# Altium schematic sheet SwitchModule.SchDoc
size A4; SheetNumber: 1; SheetTotal: 1
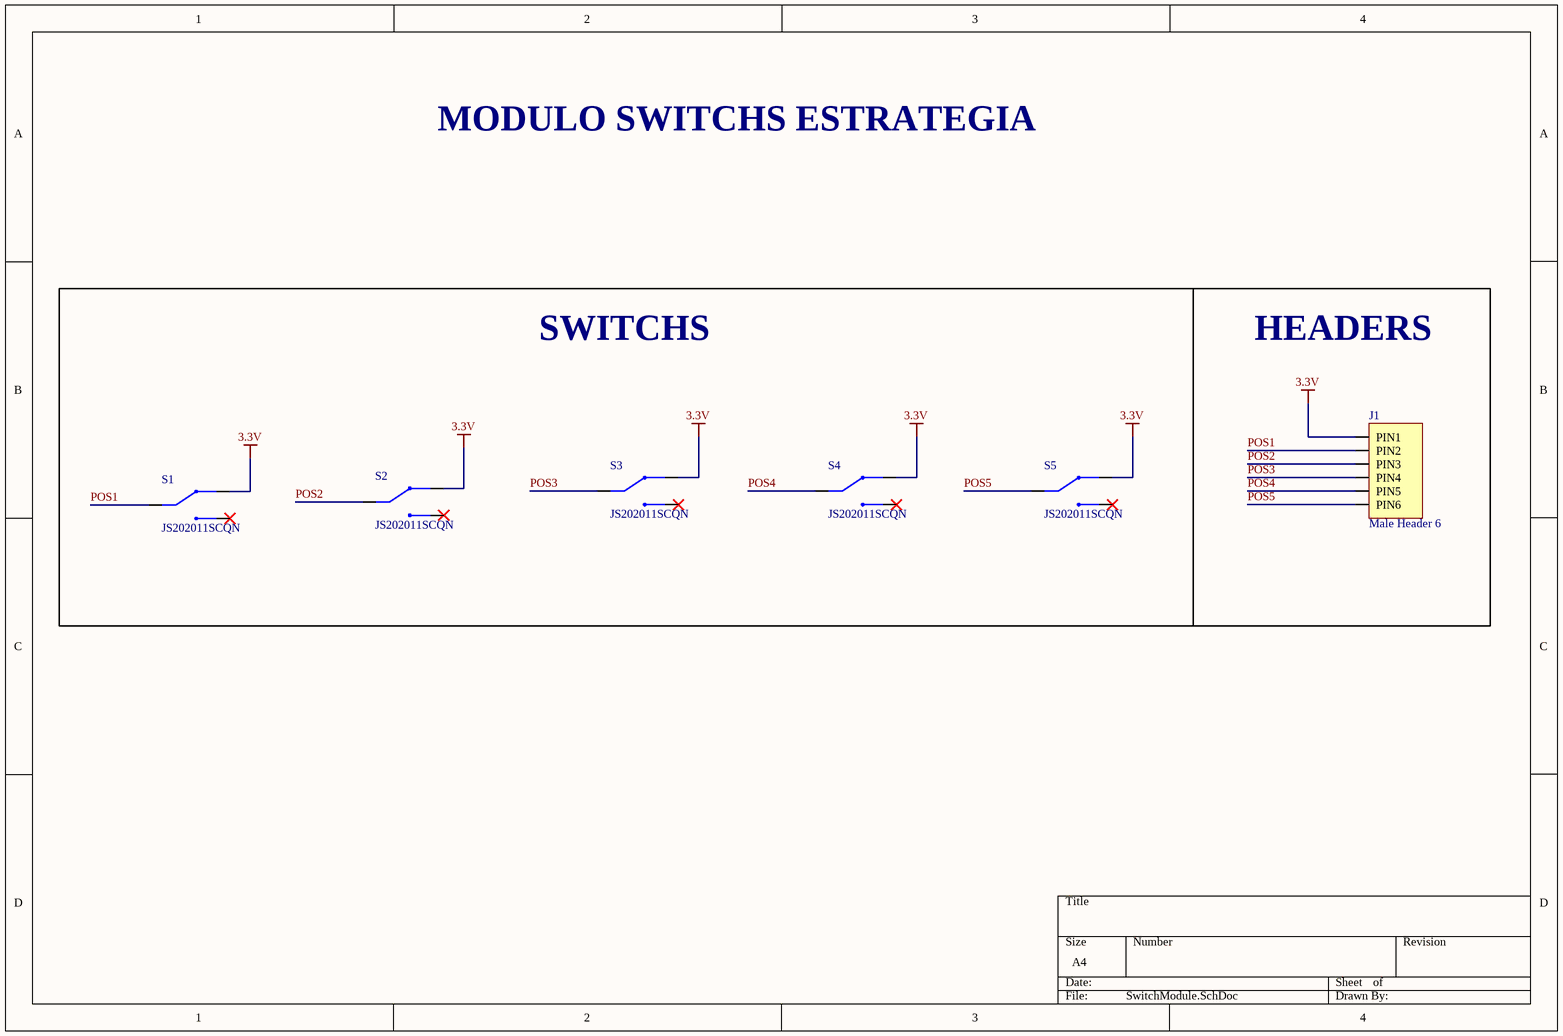
[diagram p0: SwitchModule.SchDoc]

## Parts
J1  Male Header 6  [MALE HEADER 6]
S1  JS202011SCQN  [DPDT]
S2  JS202011SCQN  [DPDT]
S3  JS202011SCQN  [DPDT]
S4  JS202011SCQN  [DPDT]
S5  JS202011SCQN  [DPDT]

## Blocks framed on the sheet
SWITCHS: S1-S5

## Nets
3.3V: J1.PIN1 S1.A2 S2.A2 S3.A2 S4.A2 S5.A2
POS1: J1.PIN2 S1.A1
POS2: J1.PIN3 S2.A1
POS3: J1.PIN4 S3.A1
POS4: J1.PIN5 S4.A1
POS5: J1.PIN6 S5.A1

Not connected (* = marked no-connect by the designer): S1 A3(3)*; S2 A3(3)*; S3 A3(3)*; S4 A3(3)*; S5 A3(3)*

## Notes on the sheet
- MODULO SWITCHS ESTRATEGIA
- HEADERS

## Library data of the parts
J1 = Male Header 6: Number of Contacts: 6; Library Control - Checked Footprint: Yes; Library Control - Person that Checked Footprint: Cage; System: Connector; Library Ref: Header; Library Control - Checked Schematic: Yes; Library Control - Last Project that Used: *; Library Control - Last Update: 02/10/2022; Library Control - Person that Checked Schematic: Cage; Library Control - Person that did the Last Update Schematic: Cage; Library Control - Persont that did the Last Update Footprint: Cage
S1-S5 = JS202011SCQN: DEEP SWITCH 4 POSITIONS; Manufacturer: C&K; Current Rating: 300 mA; Voltage Rating DC: 30 VDC; Switch Function: ON - ON; Library Control - Checked Footprint: Yes; Library Control - Person that Checked Footprint: Nikaum; Part Number: JS202011SCQN; Operating Temperature(max - min): -20~70°C; Supplier: Mouser; ComponentLink1Description: Mouser Link; ComponentLink1URL: https://br.mouser.com/ProductDetail/CK/JS202011SCQN?qs=LgMIjt8LuD95JYWxZ7NvZA%3D%3D; ComponentLink2Description: Datasheet Link; ComponentLink2URL: https://www.mouser.com/datasheet/2/60/js-1841892.pdf; Mouser Part Number: 611-JS202011SCQN; Library Ref: Diversos; Library Control - Last Update: 15/06/2021; Library Control - Person that Checked Schematic: Nikaum; Library Control - Person that did the Last Update Footprint: Nikaum; Library Control - Person that did the Last Update Schematic: Nikaum; Library Control - Checked Schematic: Yes